# EAGLE design DEC8L-buscon (EAGLE 6.6.0)
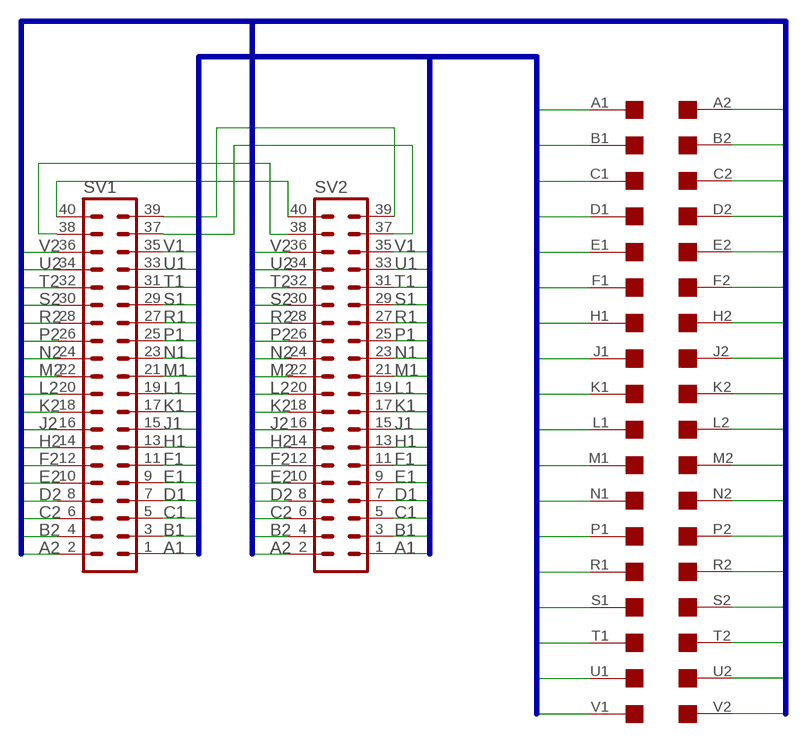
[diagram p0: schematic, sheet 1]

## Parts
SV1  MA20-2W  [MA20-2W]
SV2  MA20-2W  [MA20-2W]
U$1  DEC-FLIPCHIP  [DEC-FLIPCHIP]

## Nets
A1: SV1.1 SV2.1 U$1.A1
A2: SV1.2 SV2.2 U$1.A2
B1: SV1.3 SV2.3 U$1.B1
B2: SV1.4 SV2.4 U$1.B2
C1: SV1.5 SV2.5 U$1.C1
C2: SV1.6 SV2.6 U$1.C2
D1: SV1.7 SV2.7 U$1.D1
D2: SV1.8 SV2.8 U$1.D2
E1: SV1.9 SV2.9 U$1.E1
E2: SV1.10 SV2.10 U$1.E2
F1: SV1.11 SV2.11 U$1.F1
F2: SV1.12 SV2.12 U$1.F2
H1: SV1.13 SV2.13 U$1.H1
H2: SV1.14 SV2.14 U$1.H2
J1: SV1.15 SV2.15 U$1.J1
J2: SV1.16 SV2.16 U$1.J2
K1: SV1.17 SV2.17 U$1.K1
K2: SV1.18 SV2.18 U$1.K2
L1: SV1.19 SV2.19 U$1.L1
L2: SV1.20 SV2.20 U$1.L2
M1: SV1.21 SV2.21 U$1.M1
M2: SV1.22 SV2.22 U$1.M2
N1: SV1.23 SV2.23 U$1.N1
N2: SV1.24 SV2.24 U$1.N2
N$1: SV1.40 SV2.40
N$2: SV1.38 SV2.38
N$3: SV1.37 SV2.37
N$4: SV1.39 SV2.39
P1: SV1.25 SV2.25 U$1.P1
P2: SV1.26 SV2.26 U$1.P2
R1: SV1.27 SV2.27 U$1.R1
R2: SV1.28 SV2.28 U$1.R2
S1: SV1.29 SV2.29 U$1.S1
S2: SV1.30 SV2.30 U$1.S2
T1: SV1.31 SV2.31 U$1.T1
T2: SV1.32 SV2.32 U$1.T2
U1: SV1.33 SV2.33 U$1.U1
U2: SV1.34 SV2.34 U$1.U2
V1: SV1.35 SV2.35 U$1.V1
V2: SV1.36 SV2.36 U$1.V2

## Buses
A1,B1,C1,D1,E1,F1,H1,J1,K1,L1,M1,N1,P1,R1,S1,T1,U1,V1
A2,B2,C2,D2,E2,F2,H2,J2,K2,L2,M2,N2,P2,R2,S2,T2,U2,V2

## Library data of the parts
SV1 SV2 = con-lstb:MA20-2W: PIN HEADER; OC_FARNELL: unknown; OC_NEWARK: unknown
U$1 = con-dec:DEC-FLIPCHIP: DEC Flip-Chip single card fingers

## Board
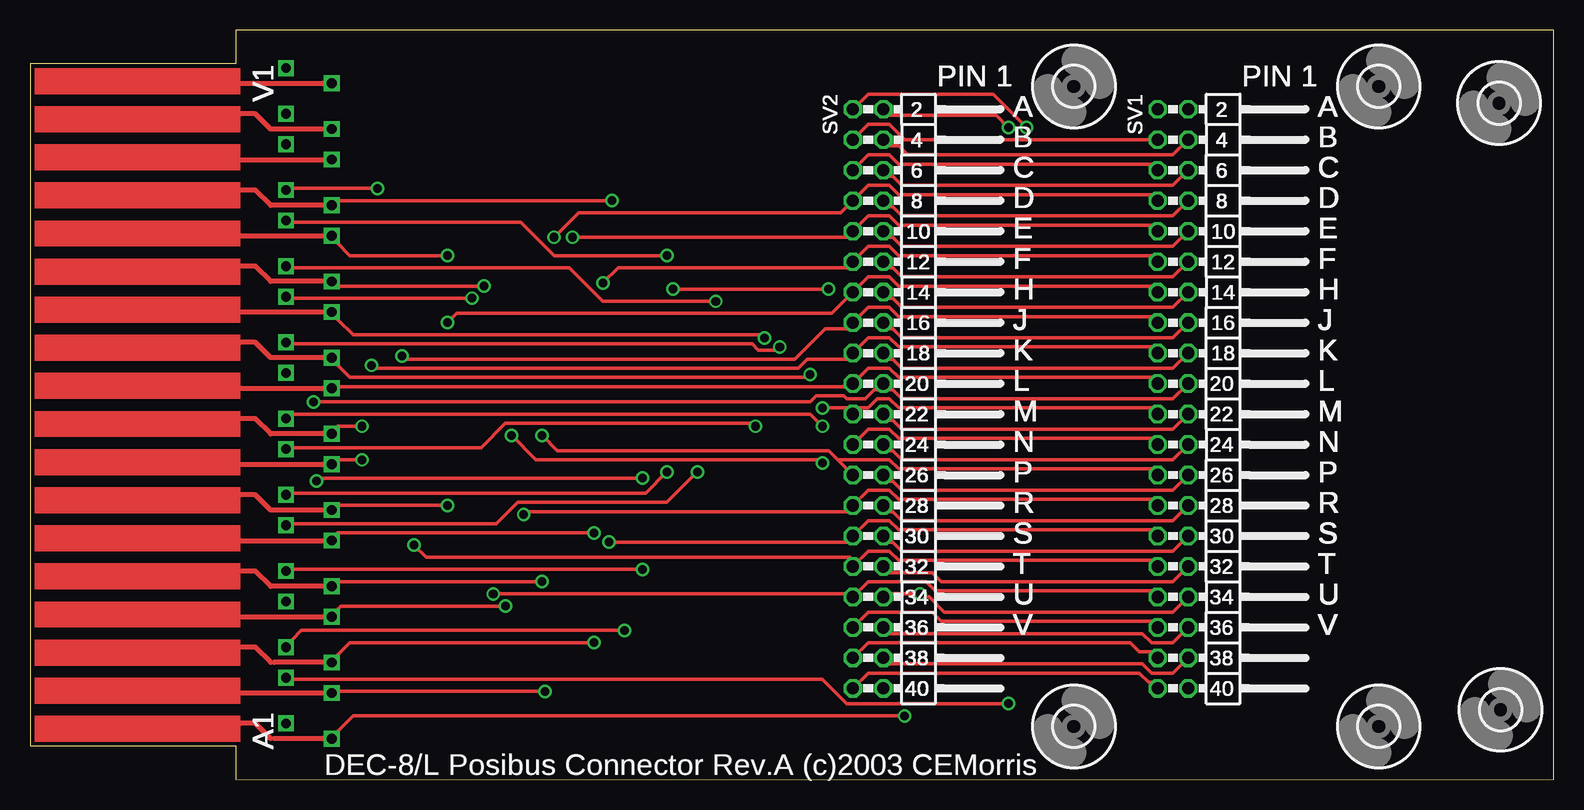
[diagram p1: board, top side]
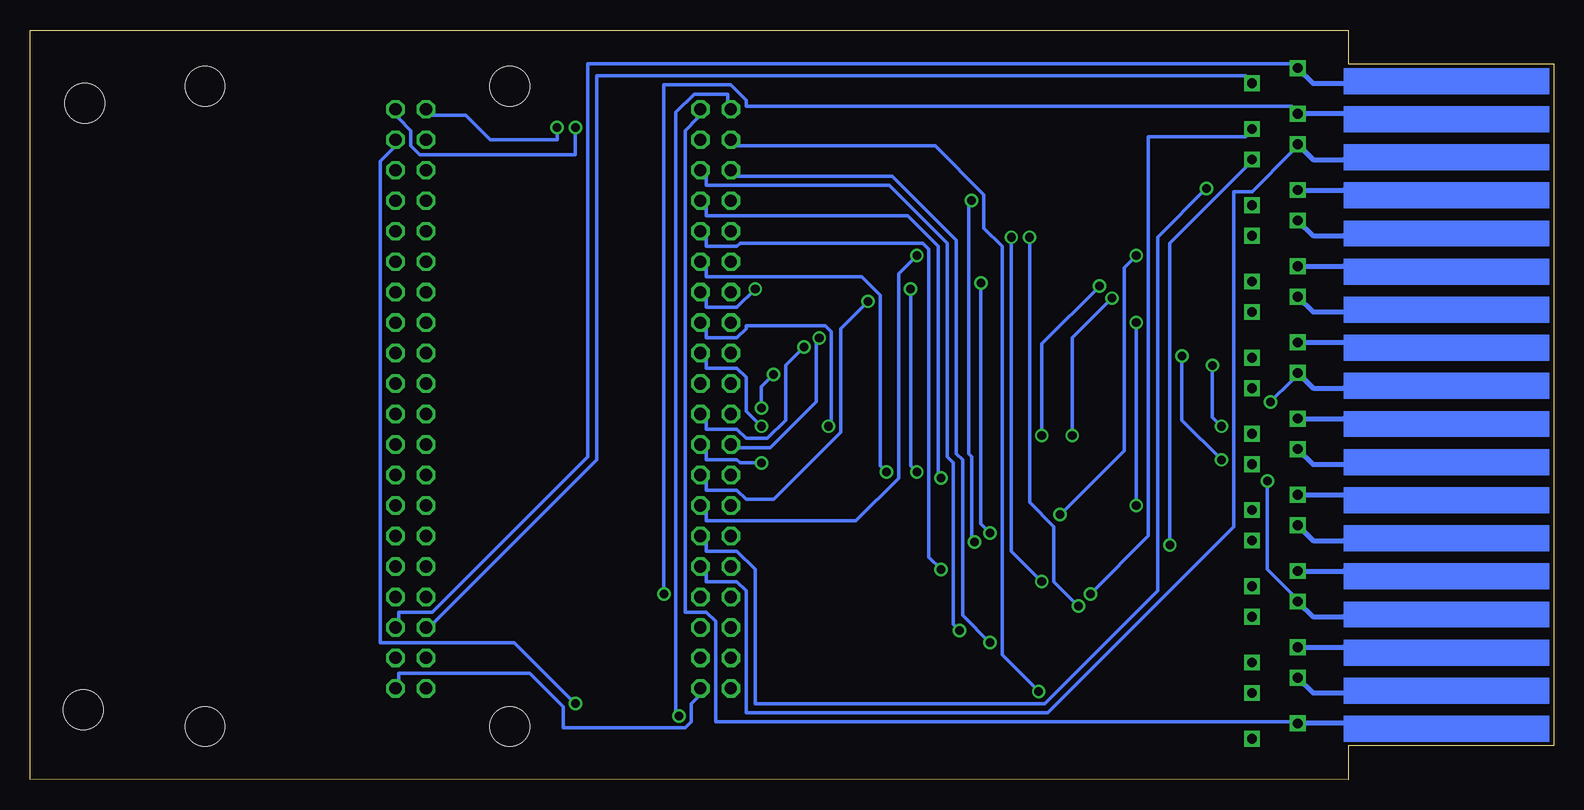
[diagram p2: board, bottom side, seen from below]

Size 126.98 x 62.48 mm. Coordinates in mm from the lower left corner, seen from the top.
Outline: 0,2.83 17.14,2.83 17.14,0 126.98,0.04 126.98,62.45 17.14,62.48 17.14,59.65 0,59.65 0,2.83
Copper layers (1*16): Top 0.035mm / dielectric 1.5mm / Bottom 0.035mm
Design rules "10mils": minimum track width 12mil, minimum drill 28mil, track to track 10mil, track to pad 10mil, pad to pad 10mil, via to via 10mil, smd to smd 10mil, copper to edge 40mil, drill to drill 10mil, minimum pad ring 10mil, minimum via ring 8mil, stop-mask expansion 0mil, vias tented up to drill 0mil, thermal gap 10mil

### Footprints (pad centres in the part's own frame; a part is rotated, then mirrored left to right if it is on the bottom)
MA20-2W = drill 1.016 octagon: 1 -24.13,-1.27; 2 -24.13,1.27; 3 -21.59,-1.27; 4 -21.59,1.27; 5 -19.05,-1.27; 6 -19.05,1.27; 7 -16.51,-1.27; 8 -16.51,1.27; 9 -13.97,-1.27; 10 -13.97,1.27; 11 -11.43,-1.27; 12 -11.43,1.27; 13 -8.89,-1.27; 14 -8.89,1.27; 15 -6.35,-1.27; 16 -6.35,1.27; 17 -3.81,-1.27; 18 -3.81,1.27; 19 -1.27,-1.27; 20 -1.27,1.27; 21 1.27,-1.27; 22 1.27,1.27; 23 3.81,-1.27; 24 3.81,1.27; 25 6.35,-1.27; 26 6.35,1.27; 27 8.89,-1.27; 28 8.89,1.27; 29 11.43,-1.27; 30 11.43,1.27; 31 13.97,-1.27; 32 13.97,1.27; 33 16.51,-1.27; 34 16.51,1.27; 35 19.05,-1.27; 36 19.05,1.27; 37 21.59,-1.27; 38 21.59,1.27; 39 24.13,-1.27; 40 24.13,1.27
DEC-FLIPCHIP = drill 0.813 square: A1 -7.62,27.94; A2 -3.81,26.67; B1 -7.62,24.13; B2 -3.81,22.86; C1 -7.62,21.59; C2 -3.81,20.32; D1 -7.62,17.78; D2 -3.81,16.51; E1 -7.62,15.24; E2 -3.81,13.97; F1 -7.62,11.43; F2 -3.81,10.16; H1 -7.62,8.89; H2 -3.81,7.62; J1 -7.62,5.08; J2 -3.81,3.81; K1 -7.62,2.54; K2 -3.81,1.27; L1 -7.62,-1.27; L2 -3.81,-2.54; M1 -7.62,-3.81; M2 -3.81,-5.08; N1 -7.62,-7.62; N2 -3.81,-8.89; P1 -7.62,-10.16; P2 -3.81,-11.43; R1 -7.62,-13.97; R2 -3.81,-15.24; S1 -7.62,-16.51; S2 -3.81,-17.78; T1 -7.62,-20.32; T2 -3.81,-21.59; U1 -7.62,-22.86; U2 -3.81,-24.13; V1 -7.62,-26.67; V2 -3.81,-27.94
3,3 = hole 3.3: 0,0

### Placement (x,y rotation side)
SV1  95.25,31.75 270 top
SV2  69.84,31.75 270 top
U$1  17.52,31.37 180 top
U$2  [3,3]  122.42,56.39 0 top
U$3  [3,3]  122.55,5.84 0 top
U$4  [3,3]  86.99,57.78 0 top
U$5  [3,3]  86.99,4.45 0 top
U$6  [3,3]  112.39,4.45 0 top
U$7  [3,3]  112.39,57.78 0 top

### Tracks (layer width: path | path; a pad name or v marks a point on that pad's centre or on a via)
A1  (via drill 0.71)
  Top 0.305: v72.89,5.33 26.92,5.33 25.65,4.06 U$1.A1 | v83.05,54.36 80.26,57.15 69.84,57.15 SV2.1
  Bottom 0.305: v72.89,5.33 73.15,5.59 73.15,55.63 71.62,57.15 68.83,57.15 68.83,56.64 SV2.1 | v83.05,54.36 83.05,53.34 88.64,53.34 90.67,55.37 93.47,55.37 SV1.1
A2  (via drill 0.71)
  Top 0.305: v81.53,54.36 80.51,55.37 71.62,55.37 SV2.2
  Bottom 0.305: U$1.A2 21.84,4.83 69.84,4.83 69.84,13.21 70.61,13.97 72.39,13.97 72.39,54.1 71.37,55.12 SV2.2 | v81.53,54.36 81.53,52.07 94.48,52.07 95.25,52.83 95.25,54.1 96.26,55.12 SV1.2
B1  (via drill 0.71)
  Top 0.305: v42.92,7.37 25.65,7.37 U$1.B1 | SV1.3 72.89,53.34 71.62,54.61 69.84,54.61 SV2.3
  Bottom 0.305: v42.92,7.37 45.97,10.41 45.97,44.45 47.49,45.97 47.49,48.77 51.56,52.83 68.07,52.83 SV2.3
B2  (via drill 0.71)
  Top 0.305: v81.53,6.35 68.07,6.35 66.04,8.38 21.84,8.38 U$1.B2 | SV2.4 71.62,52.83 72.39,52.83 73.15,52.07 95.25,52.07 SV1.4
  Bottom 0.305: v81.53,6.35 86.61,11.43 97.79,11.43 97.79,51.56 96.77,52.58 SV1.4
C1  (via drill 0.71)
  Top 0.305: v46.98,11.43 26.67,11.43 25.65,10.41 U$1.C1 | SV1.5 93.47,51.31 72.39,51.31 71.62,52.07 69.84,52.07 SV2.5
  Bottom 0.305: v46.98,11.43 49.27,13.72 49.27,26.67 49.78,27.18 49.78,44.96 55.11,50.29 68.07,50.29 SV2.5
C2  (via drill 0.71)
  Top 0.305: v49.52,12.45 22.6,12.45 21.84,11.68 U$1.C2 | SV1.6 95.25,49.53 72.64,49.53 71.88,50.29 71.62,50.29 SV2.6
  Bottom 0.305: v49.52,12.45 50.03,12.95 50.03,26.42 50.54,26.92 50.54,44.7 55.37,49.53 70.61,49.53 70.61,50.29 SV2.6
D1  (via drill 0.71)
  Top 0.305: v39.62,14.48 25.9,14.48 25.65,14.22 U$1.D1 | v43.68,45.21 45.71,47.24 67.56,47.24 SV2.7 69.84,49.53 71.62,49.53 72.39,48.77 93.47,48.77 SV1.7
  Bottom 0.305: v39.62,14.48 41.65,16.51 41.65,21.08 43.68,23.11 v43.68,45.21
D2  (via drill 0.71)
  Top 0.305: v23.87,24.89 24.12,25.15 v51.05,25.15 | SV1.8 95.25,46.99 72.64,46.99 71.88,47.75 71.62,47.75 SV2.8
  Bottom 0.305: v23.87,24.89 23.87,17.53 21.84,15.49 U$1.D2 | v51.05,25.15 51.3,25.4 51.3,44.45 53.84,46.99 70.61,46.99 70.61,47.75 SV2.8
E1  (via drill 0.71)
  Top 0.305: v42.67,16.51 25.65,16.51 U$1.E1 | v45.21,45.21 68.07,45.21 SV2.9 69.84,46.99 71.62,46.99 72.39,46.23 93.47,46.23 SV1.9
  Bottom 0.305: v42.67,16.51 45.21,19.05 v45.21,45.21
E2  (via drill 0.71)
  Top 0.305: v51.05,17.53 21.84,17.53 U$1.E2 | SV1.10 95.25,44.45 72.64,44.45 71.88,45.21 71.62,45.21 SV2.10
  Bottom 0.305: v51.05,17.53 52.06,18.54 52.06,44.2 52.57,44.7 67.81,44.7 68.07,44.45 70.61,44.45 70.61,45.21 SV2.10
F1  (via drill 0.71)
  Top 0.305: v46.98,20.57 25.65,20.57 U$1.F1 | v47.75,41.4 49.02,42.67 68.07,42.67 SV2.11 69.84,44.45 71.62,44.45 72.39,43.69 93.47,43.69 SV1.11
  Bottom 0.305: v46.98,20.57 47.75,21.34 v47.75,41.4
F2  (via drill 0.71)
  Top 0.305: v55.62,25.65 53.08,23.11 40.63,23.11 38.86,21.34 21.84,21.34 U$1.F2 | SV1.12 95.25,41.91 72.64,41.91 71.88,42.67 71.62,42.67 SV2.12
  Bottom 0.305: v55.62,25.65 56.13,26.16 56.13,40.39 57.65,41.91 70.61,41.91 70.61,42.67 SV2.12
H1  (via drill 0.71)
  Top 0.305: v34.79,22.86 25.65,22.86 U$1.H1 | v34.79,38.1 35.55,38.86 66.8,38.86 SV2.13 69.84,41.91 71.62,41.91 72.39,41.15 93.47,41.15 SV1.13
  Bottom 0.305: v34.79,22.86 v34.79,38.1
H2  (via drill 0.71)
  Top 0.305: v53.08,25.65 51.3,23.88 21.84,23.88 U$1.H2 | v53.59,40.89 v66.54,40.89 | SV1.14 95.25,39.37 72.64,39.37 71.88,40.13 71.62,40.13 SV2.14
  Bottom 0.305: v53.08,25.65 53.59,26.16 v53.59,40.89 | v66.54,40.89 68.07,39.37 70.61,39.37 70.61,40.13 SV2.14
J1  (via drill 0.71)
  Top 0.305: v27.68,26.67 25.65,26.67 U$1.J1 | v30.98,35.31 31.24,35.05 63.75,35.05 66.29,37.59 68.07,37.59 SV2.15 69.84,39.37 71.62,39.37 72.39,38.61 93.47,38.61 SV1.15
  Bottom 0.305: v27.68,26.67 30.98,29.97 v30.98,35.31
J2  (via drill 0.71)
  Top 0.305: v60.45,29.46 60.19,29.72 39.62,29.72 37.59,27.69 21.84,27.69 U$1.J2 | SV1.16 95.25,36.83 72.64,36.83 71.88,37.59 71.62,37.59 SV2.16
  Bottom 0.305: v60.45,29.46 60.19,29.72 60.19,37.34 60.7,37.85 67.31,37.85 67.31,37.59 68.07,36.83 70.61,36.83 70.61,37.59 SV2.16
K1  (via drill 0.71)
  Top 0.305: v27.68,29.46 25.65,29.46 U$1.K1 | v28.44,34.54 28.7,34.29 64,34.29 64.77,35.05 68.07,35.05 SV2.17 69.84,36.83 71.62,36.83 72.39,36.07 93.47,36.07 SV1.17
  Bottom 0.305: v27.68,29.46 28.44,30.23 v28.44,34.54
K2  (via drill 0.71)
  Top 0.305: v66.04,29.46 65.02,30.48 21.84,30.48 U$1.K2 | SV1.18 95.25,34.29 72.64,34.29 71.88,35.05 71.62,35.05 SV2.18
  Bottom 0.305: v66.04,29.46 67.31,30.73 67.31,33.53 68.07,34.29 70.61,34.29 70.61,35.05 SV2.18
L1
  Top 0.305: U$1.L1 25.65,32.77 68.07,32.77 SV2.19 69.84,34.29 71.62,34.29 72.39,33.53 93.47,33.53 SV1.19
L2  (via drill 0.71)
  Top 0.305: v23.62,31.5 65.02,31.5 65.53,32 67.81,32 68.07,31.75 69.59,31.75 70.35,32.51 70.61,32.51 SV2.20 71.62,32.51 71.88,32.51 72.64,31.75 95.25,31.75 SV1.20
  Bottom 0.305: v23.62,31.5 21.84,33.27 U$1.L2
M1  (via drill 0.71)
  Top 0.305: v65.02,33.78 64.77,33.53 26.67,33.53 25.65,34.54 U$1.M1 | v66.04,30.99 68.07,30.99 SV2.21 69.08,30.99 69.84,30.99 70.61,31.75 71.62,31.75 72.39,30.99 93.47,30.99 SV1.21
  Bottom 0.305: v65.02,33.78 66.04,32.77 v66.04,30.99
M2  (via drill 0.71)
  Top 0.305: v62.48,36.07 62.22,35.81 60.7,35.81 60.19,36.32 21.84,36.32 U$1.M2 | SV1.22 95.25,29.21 72.64,29.21 71.88,29.97 71.62,29.97 SV2.22
  Bottom 0.305: v62.48,36.07 64,34.54 64,29.97 65.53,28.45 67.31,28.45 68.07,29.21 70.61,29.21 70.61,29.97 SV2.22
N1  (via drill 0.71)
  Top 0.305: v61.21,36.83 60.95,37.08 26.92,37.08 25.65,38.35 U$1.N1 | SV1.23 93.47,28.45 72.39,28.45 71.62,29.21 69.84,29.21 SV2.23
  Bottom 0.305: v61.21,36.83 61.46,36.58 61.46,31.5 65.27,27.69 68.07,27.69 SV2.23
N2  (via drill 0.71)
  Top 0.305: v36.82,40.13 21.84,40.13 U$1.N2 | v40.13,28.7 42.16,26.67 65.78,26.67 v66.04,26.42 | SV1.24 95.25,26.67 72.64,26.67 71.88,27.43 71.62,27.43 SV2.24
  Bottom 0.305: v36.82,40.13 40.13,36.83 v40.13,28.7 | v66.04,26.42 67.81,26.42 68.07,26.67 70.61,26.67 70.61,27.43 SV2.24
N$1
  Bottom 0.305: SV2.40 71.37,6.86 71.88,6.35 71.88,4.83 72.39,4.32 82.55,4.32 82.55,6.1 85.34,8.89 96.26,8.89 96.26,8.38 SV1.40
N$2
  Top 0.305: SV2.38 71.62,9.65 92.7,9.65 93.47,8.89 95.25,8.89 SV1.38
N$3
  Top 0.305: SV2.37 69.84,11.43 91.69,11.43 92.45,10.67 93.47,10.67 SV1.37
N$4
  Top 0.305: SV2.39 69.84,8.89 92.45,8.89 93.21,8.13 93.47,8.13 SV1.39
P1  (via drill 0.71)
  Top 0.305: v37.84,41.15 25.65,41.15 U$1.P1 | v42.67,28.7 43.94,27.43 66.54,27.43 67.31,26.67 | 67.31,26.67 SV2.25 | 67.31,26.67 71.62,26.67 72.39,25.91 93.47,25.91 SV1.25
  Bottom 0.305: v37.84,41.15 42.67,36.32 v42.67,28.7
P2  (via drill 0.71)
  Top 0.305: v57.14,39.88 47.75,39.88 44.95,42.67 21.84,42.67 U$1.P2 | SV1.26 95.25,24.13 72.64,24.13 71.88,24.89 71.62,24.89 SV2.26
  Bottom 0.305: v57.14,39.88 59.43,37.59 59.43,28.96 65.02,23.37 67.31,23.37 68.07,24.13 70.61,24.13 70.61,24.89 SV2.26
R1  (via drill 0.71)
  Top 0.305: v34.79,43.69 26.67,43.69 25.65,44.7 U$1.R1 | v41.14,22.1 41.4,22.35 68.07,22.35 SV2.27 69.84,24.13 71.62,24.13 72.39,23.37 93.47,23.37 SV1.27
  Bottom 0.305: v34.79,43.69 35.81,42.67 35.81,27.43 v41.14,22.1
R2  (via drill 0.71)
  Top 0.305: v53.08,43.69 43.68,43.69 40.89,46.48 21.84,46.48 U$1.R2 | SV1.28 95.25,21.59 72.64,21.59 71.88,22.35 71.62,22.35 SV2.28
  Bottom 0.305: v53.08,43.69 54.6,42.16 54.6,25.15 58.16,21.59 70.61,21.59 70.61,22.35 SV2.28
S1  (via drill 0.71)
  Top 0.305: v48.51,48.26 25.65,48.26 U$1.S1 | v48.25,19.81 68.07,19.81 SV2.29 69.84,21.59 71.62,21.59 72.39,20.83 93.47,20.83 SV1.29
  Bottom 0.305: v48.51,48.26 48.76,48.01 48.76,27.18 48.51,26.92 48.51,20.07 v48.25,19.81
S2  (via drill 0.71)
  Top 0.305: v28.95,49.28 21.84,49.28 U$1.S2 | SV1.30 95.25,19.05 72.64,19.05 71.88,19.81 71.62,19.81 SV2.30
  Bottom 0.305: v28.95,49.28 33.02,45.21 33.02,15.75 42.41,6.35 66.54,6.35 66.54,17.53 68.07,19.05 70.61,19.05 70.61,19.81 SV2.30
T1  (via drill 0.71)
  Top 0.305: v32,19.56 33.02,18.54 68.32,18.54 SV2.31 69.84,19.05 71.62,19.05 72.39,18.29 93.47,18.29 SV1.31
  Bottom 0.305: v32,19.56 32,44.7 25.65,51.05 U$1.T1
T2
  Top 0.305: SV1.32 95.25,16.51 75.94,16.51 75.18,17.27 71.62,17.27 SV2.32
  Bottom 0.305: U$1.T2 21.84,52.32 25.14,49.02 26.67,49.02 26.67,21.08 42.16,5.59 67.31,5.59 67.31,15.75 68.07,16.51 70.61,16.51 70.61,17.27 SV2.32
U1  (via drill 0.71)
  Top 0.305: v38.6,15.49 68.07,15.49 SV2.33 69.84,16.51 74.67,16.51 75.43,15.75 93.47,15.75 SV1.33
  Bottom 0.305: v38.6,15.49 33.78,20.32 33.78,53.59 25.65,53.59 U$1.U1
U2  (via drill 0.71)
  Top 0.305: SV2.34 71.62,15.49 v74.16,15.49 74.67,15.24 74.93,15.24 76.2,13.97 95.25,13.97 SV1.34
  Bottom 0.305: v74.16,15.49 74.16,57.91 68.58,57.91 67.31,56.64 67.31,56.13 21.84,56.13 U$1.U2
V1
  Top 0.305: SV2.35 69.84,13.97 75.18,13.97 75.94,13.21 93.47,13.21 SV1.35
  Bottom 0.305: U$1.V1 25.65,58.67 79.75,58.67 79.75,26.67 93.47,12.95 SV1.35
V2
  Top 0.305: SV2.36 71.62,12.19 92.7,12.19 93.47,11.43 95.25,11.43 SV1.36
  Bottom 0.305: U$1.V2 21.84,59.69 80.51,59.69 80.51,26.92 93.47,13.97 96.26,13.97 96.26,13.46 SV1.36

### Text on the board
tPlace: 2 | 2 | 2 | 2 | 2 | 2 | 2 | 2 | 2 | 2 | 2 | 2 | 2 | 2 | 2 | 2 | 2 | 2 | 2 | 2 | 2 | 2 | 2 | 2 | 2 | 2 | 2 | 2 | 2 | 2 | 2 | 2 | 2 | 2 | 2 | 2 | 2 | 2 | 2 | 2 | 2 | 2 | 2 | 2 | 2 | 2 | 2 | 2 | 2 | 2 | 2 | 2 | 2 | 2 | 2 | 2 | 2 | 2 | 2 | 2 | 2 | 2 | 4 | 4 | 4 | 4 | 4 | 4 | 4 | 4 | 4 | 4 | 4 | 4 | 4 | 4 | 4 | 4 | 4 | 4 | 4 | 4 | 4 | 4 | 4 | 4 | 4 | 4 | 4 | 4 | 4 | 4 | 4 | 4 | 4 | 4 | 4 | 4 | 4 | 4 | 4 | 4 | 4 | 4 | 4 | 4 | 4 | 4 | 4 | 4 | 4 | 4 | 4 | 4 | 4 | 4 | 4 | 4 | 4 | 4 | 4 | 4 | 4 | 4 | 6 | 6 | 6 | 6 | 6 | 6 | 6 | 6 | 6 | 6 | 6 | 6 | 6 | 6 | 6 | 6 | 6 | 6 | 6 | 6 | 6 | 6 | 6 | 6 | 6 | 6 | 6 | 6 | 6 | 6 | 6 | 6 | 6 | 6 | 6 | 6 | 6 | 6 | 6 | 6 | 6 | 6 | 6 | 6 | 6 | 6 | 6 | 6 | 6 | 6 | 6 | 6 | 6 | 6 | 6 | 6 | 6 | 6 | 6 | 6 | 6 | 6 | 8 | 8 | 8 | 8 | 8 | 8 | 8 | 8 | 8 | 8 | 8 | 8 | 8 | 8 | 8 | 8 | 8 | 8 | 8 | 8 | 8 | 8 | 8 | 8 | 8 | 8 | 8 | 8 | 8 | 8 | 8 | 8 | 8 | 8 | 8 | 8 | 8 | 8 | 8 | 8 | 8 | 8 | 8 | 8 | 8 | 8 | 8 | 8 | 8 | 8 | 8 | 8 | 8 | 8 | 8 | 8 | 8 | 8 | 8 | 8 | 8 | 8 | 10 | 10 | 10 | 10 | 10 | 10 | 10 | 10 | 10 | 10 | 10 | 10 | 10 | 10 | 10 | 10 | 10 | 10 | 10 | 10 | 10 | 10 | 10 | 10 | 10 | 10 | 10 | 10 | 10 | 10 | 10 | 10 | 10 | 10 | 10 | 10 | 10 | 10 | 10 | 10 | 10 | 10 | 10 | 10 | 10 | 10 | 10 | 10 | 10 | 10 | 10 | 10 | 10 | 10 | 10 | 10 | 10 | 10 | 10 | 10 | 10 | 10 | 12 | 12 | 12 | 12 | 12 | 12 | 12 | 12 | 12 | 12 | 12 | 12 | 12 | 12 | 12 | 12 | 12 | 12 | 12 | 12 | 12 | 12 | 12 | 12 | 12 | 12 | 12 | 12 | 12 | 12 | 12 | 12 | 12 | 12 | 12 | 12 | 12 | 12 | 12 | 12 | 12 | 12 | 12 | 12 | 12 | 12 | 12 | 12 | 12 | 12 | 12 | 12 | 12 | 12 | 12 | 12 | 12 | 12 | 12 | 12 | 12 | 12 | 14 | 14 | 14 | 14 | 14 | 14 | 14 | 14 | 14 | 14 | 14 | 14 | 14 | 14 | 14 | 14 | 14 | 14 | 14 | 14 | 14 | 14 | 14 | 14 | 14 | 14 | 14 | 14 | 14 | 14 | 14 | 14 | 14 | 14 | 14 | 14 | 14 | 14 | 14 | 14 | 14 | 14 | 14 | 14 | 14 | 14 | 14 | 14 | 14 | 14 | 14 | 14 | 14 | 14 | 14 | 14 | 14 | 14 | 14 | 14 | 14 | 14 | 16 | 16 | 16 | 16 | 16 | 16 | 16 | 16 | 16 | 16 | 16 | 16 | 16 | 16 | 16 | 16 | 16 | 16 | 16 | 16 | 16 | 16 | 16 | 16 | 16 | 16 | 16 | 16 | 16 | 16 | 16 | 16 | 16 | 16 | 16 | 16 | 16 | 16 | 16 | 16 | 16 | 16 | 16 | 16 | 16 | 16 | 16 | 16 | 16 | 16 | 16 | 16 | 16 | 16 | 16 | 16 | 16 | 16 | 16 | 16 | 16 | 16 | 18 | 18 | 18 | 18 | 18 | 18 | 18 | 18 | 18 | 18 | 18 | 18 | 18 | 18 | 18 | 18 | 18 | 18 | 18 | 18 | 18 | 18 | 18 | 18 | 18 | 18 | 18 | 18 | 18 | 18 | 18 | 18 | 18 | 18 | 18 | 18 | 18 | 18 | 18 | 18 | 18 | 18 | 18 | 18 | 18 | 18 | 18 | 18 | 18 | 18 | 18 | 18 | 18 | 18 | 18 | 18 | 18 | 18 | 18 | 18 | 18 | 18 | 20 | 20 | 20 | 20 | 20 | 20 | 20 | 20 | 20 | 20 | 20 | 20 | 20 | 20 | 20 | 20 | 20 | 20 | 20 | 20 | 20 | 20 | 20 | 20 | 20 | 20 | 20 | 20 | 20 | 20 | 20 | 20 | 20 | 20 | 20 | 20 | 20 | 20 | 20 | 20 | 20 | 20 | 20 | 20 | 20 | 20 | 20 | 20 | 20 | 20 | 20 | 20 | 20 | 20 | 20 | 20 | 20 | 20 | 20 | 20 | 20 | 20 | 22 | 22 | 22 | 22 | 22 | 22 | 22 | 22 | 22 | 22 | 22 | 22 | 22 | 22 | 22 | 22 | 22 | 22 | 22 | 22 | 22 | 22 | 22 | 22 | 22 | 22 | 22 | 22 | 22 | 22 | 22 | 22 | 22 | 22 | 22 | 22 | 22 | 22 | 22 | 22 | 22 | 22 | 22 | 22 | 22 | 22 | 22 | 22 | 22 | 22 | 22 | 22 | 22 | 22 | 22 | 22 | 22 | 22 | 22 | 22 | 22 | 22 | 24 | 24 | 24 | 24 | 24 | 24 | 24 | 24 | 24 | 24 | 24 | 24 | 24 | 24 | 24 | 24 | 24 | 24 | 24 | 24 | 24 | 24 | 24 | 24 | 24 | 24 | 24 | 24 | 24 | 24 | 24 | 24 | 24 | 24 | 24 | 24 | 24 | 24 | 24 | 24 | 24 | 24 | 24 | 24 | 24 | 24 | 24 | 24 | 24 | 24 | 24 | 24 | 24 | 24 | 24 | 24 | 24 | 24 | 24 | 24 | 24 | 24 | 26 | 26 | 26 | 26 | 26 | 26 | 26 | 26 | 26 | 26 | 26 | 26 | 26 | 26 | 26 | 26 | 26 | 26 | 26 | 26 | 26 | 26 | 26 | 26 | 26 | 26 | 26 | 26 | 26 | 26 | 26 | 26 | 26 | 26 | 26 | 26 | 26 | 26 | 26 | 26 | 26 | 26 | 26 | 26 | 26 | 26 | 26 | 26 | 26 | 26 | 26 | 26 | 26 | 26 | 26 | 26 | 26 | 26 | 26 | 26 | 26 | 26 | 28 | 28 | 28 | 28 | 28 | 28 | 28 | 28 | 28 | 28 | 28 | 28 | 28 | 28 | 28 | 28 | 28 | 28 | 28 | 28 | 28 | 28 | 28 | 28 | 28 | 28 | 28 | 28 | 28 | 28 | 28 | 28 | 28 | 28 | 28 | 28 | 28 | 28 | 28 | 28 | 28 | 28 | 28 | 28 | 28 | 28 | 28 | 28 | 28 | 28 | 28 | 28 | 28 | 28 | 28 | 28 | 28 | 28 | 28 | 28 | 28 | 28 | 30 | 30 | 30 | 30 | 30 | 30 | 30 | 30 | 30 | 30 | 30 | 30 | 30 | 30 | 30 | 30 | 30 | 30 | 30 | 30 | 30 | 30 | 30 | 30 | 30 | 30 | 30 | 30 | 30 | 30 | 30 | 30 | 30 | 30 | 30 | 30 | 30 | 30 | 30 | 30 | 30 | 30 | 30 | 30 | 30 | 30 | 30 | 30 | 30 | 30 | 30 | 30 | 30 | 30 | 30 | 30 | 30 | 30 | 30 | 30 | 30 | 30 | 32 | 32 | 32 | 32 | 32 | 32 | 32 | 32 | 32 | 32 | 32 | 32 | 32 | 32 | 32 | 32 | 32 | 32 | 32 | 32 | 32 | 32 | 32 | 32 | 32 | 32 | 32 | 32 | 32 | 32 | 32 | 32 | 32 | 32 | 32 | 32 | 32 | 32 | 32 | 32 | 32 | 32 | 32 | 32 | 32 | 32 | 32 | 32 | 32 | 32 | 32 | 32 | 32 | 32 | 32 | 32 | 32 | 32 | 32 | 32 | 32 | 32 | 34 | 34 | 34 | 34 | 34 | 34 | 34 | 34 | 34 | 34 | 34 | 34 | 34 | 34 | 34 | 34 | 34 | 34 | 34 | 34 | 34 | 34 | 34 | 34 | 34 | 34 | 34 | 34 | 34 | 34 | 34 | 34 | 34 | 34 | 34 | 34 | 34 | 34 | 34 | 34 | 34 | 34 | 34 | 34 | 34 | 34 | 34 | 34 | 34 | 34 | 34 | 34 | 34 | 34 | 34 | 34 | 34 | 34 | 34 | 34 | 34 | 34 | 36 | 36 | 36 | 36 | 36 | 36 | 36 | 36 | 36 | 36 | 36 | 36 | 36 | 36 | 36 | 36 | 36 | 36 | 36 | 36 | 36 | 36 | 36 | 36 | 36 | 36 | 36 | 36 | 36 | 36 | 36 | 36 | 36 | 36 | 36 | 36 | 36 | 36 | 36 | 36 | 36 | 36 | 36 | 36 | 36 | 36 | 36 | 36 | 36 | 36 | 36 | 36 | 36 | 36 | 36 | 36 | 36 | 36 | 36 | 36 | 36 | 36 | 38 | 38 | 38 | 38 | 38 | 38 | 38 | 38 | 38 | 38 | 38 | 38 | 38 | 38 | 38 | 38 | 38 | 38 | 38 | 38 | 38 | 38 | 38 | 38 | 38 | 38 | 38 | 38 | 38 | 38 | 38 | 38 | 38 | 38 | 38 | 38 | 38 | 38 | 38 | 38 | 38 | 38 | 38 | 38 | 38 | 38 | 38 | 38 | 38 | 38 | 38 | 38 | 38 | 38 | 38 | 38 | 38 | 38 | 38 | 38 | 38 | 38 | 40 | 40 | 40 | 40 | 40 | 40 | 40 | 40 | 40 | 40 | 40 | 40 | 40 | 40 | 40 | 40 | 40 | 40 | 40 | 40 | 40 | 40 | 40 | 40 | 40 | 40 | 40 | 40 | 40 | 40 | 40 | 40 | 40 | 40 | 40 | 40 | 40 | 40 | 40 | 40 | 40 | 40 | 40 | 40 | 40 | 40 | 40 | 40 | 40 | 40 | 40 | 40 | 40 | 40 | 40 | 40 | 40 | 40 | 40 | 40 | 40 | 40
tNames: PIN 1 | PIN 1 | PIN 1 | PIN 1 | PIN 1 | PIN 1 | PIN 1 | PIN 1 | PIN 1 | PIN 1 | PIN 1 | PIN 1 | PIN 1 | PIN 1 | PIN 1 | PIN 1 | PIN 1 | PIN 1 | PIN 1 | PIN 1 | PIN 1 | PIN 1 | PIN 1 | PIN 1 | PIN 1 | PIN 1 | PIN 1 | PIN 1 | PIN 1 | PIN 1 | PIN 1 | PIN 1 | PIN 1 | PIN 1 | PIN 1 | PIN 1 | PIN 1 | PIN 1 | PIN 1 | PIN 1 | PIN 1 | PIN 1 | PIN 1 | PIN 1 | PIN 1 | PIN 1 | PIN 1 | PIN 1 | PIN 1 | PIN 1 | PIN 1 | PIN 1 | PIN 1 | PIN 1 | PIN 1 | PIN 1 | PIN 1 | PIN 1 | PIN 1 | PIN 1 | PIN 1 | PIN 1 | PIN 1 | PIN 1 | V1 | V1 | V1 | V1 | V1 | V1 | V1 | V1 | V1 | V1 | V1 | V1 | V1 | V1 | V1 | V1 | V1 | V1 | V1 | V1 | V1 | V1 | V1 | V1 | V1 | V1 | V1 | V1 | V1 | V1 | V1 | V1 | SV2 | SV2 | SV2 | SV2 | SV2 | SV2 | SV2 | SV2 | SV2 | SV2 | SV2 | SV2 | SV2 | SV2 | SV2 | SV2 | SV2 | SV2 | SV2 | SV2 | SV2 | SV2 | SV2 | SV2 | SV2 | SV2 | SV2 | SV2 | SV2 | SV1 | SV1 | SV1 | SV1 | SV1 | SV1 | SV1 | SV1 | SV1 | SV1 | SV1 | SV1 | SV1 | SV1 | SV1 | SV1 | SV1 | SV1 | SV1 | SV1 | SV1 | SV1 | SV1 | SV1 | SV1 | SV1 | SV1 | SV1 | SV1 | A | A | A | A | A | A | A | A | A | A | A | A | A | A | A | A | A | A | A | A | A | A | A | A | A | A | A | A | A | A | A | A | A | A | A | A | A | A | A | A | A | A | A | A | A | A | A | A | A | A | A | A | A | A | A | A | A | A | A | A | A | A | A | A | B | B | B | B | B | B | B | B | B | B | B | B | B | B | B | B | B | B | B | B | B | B | B | B | B | B | B | B | B | B | B | B | B | B | B | B | B | B | B | B | B | B | B | B | B | B | B | B | B | B | B | B | B | B | B | B | B | B | B | B | B | B | B | B | C | C | C | C | C | C | C | C | C | C | C | C | C | C | C | C | C | C | C | C | C | C | C | C | C | C | C | C | C | C | C | C | C | C | C | C | C | C | C | C | C | C | C | C | C | C | C | C | C | C | C | C | C | C | C | C | C | C | C | C | C | C | C | C | D | D | D | D | D | D | D | D | D | D | D | D | D | D | D | D | D | D | D | D | D | D | D | D | D | D | D | D | D | D | D | D | D | D | D | D | D | D | D | D | D | D | D | D | D | D | D | D | D | D | D | D | D | D | D | D | D | D | D | D | D | D | D | D | E | E | E | E | E | E | E | E | E | E | E | E | E | E | E | E | E | E | E | E | E | E | E | E | E | E | E | E | E | E | E | E | E | E | E | E | E | E | E | E | E | E | E | E | E | E | E | E | E | E | E | E | E | E | E | E | E | E | E | E | E | E | E | E | F | F | F | F | F | F | F | F | F | F | F | F | F | F | F | F | F | F | F | F | F | F | F | F | F | F | F | F | F | F | F | F | F | F | F | F | F | F | F | F | F | F | F | F | F | F | F | F | F | F | F | F | F | F | F | F | F | F | F | F | F | F | F | F | H | H | H | H | H | H | H | H | H | H | H | H | H | H | H | H | H | H | H | H | H | H | H | H | H | H | H | H | H | H | H | H | H | H | H | H | H | H | H | H | H | H | H | H | H | H | H | H | H | H | H | H | H | H | H | H | H | H | H | H | H | H | H | H | J | J | J | J | J | J | J | J | J | J | J | J | J | J | J | J | J | J | J | J | J | J | J | J | J | J | J | J | J | J | J | J | J | J | J | J | J | J | J | J | J | J | J | J | J | J | J | J | J | J | J | J | J | J | J | J | J | J | J | J | J | J | J | J | K | K | K | K | K | K | K | K | K | K | K | K | K | K | K | K | K | K | K | K | K | K | K | K | K | K | K | K | K | K | K | K | K | K | K | K | K | K | K | K | K | K | K | K | K | K | K | K | K | K | K | K | K | K | K | K | K | K | K | K | K | K | K | K | L | L | L | L | L | L | L | L | L | L | L | L | L | L | L | L | L | L | L | L | L | L | L | L | L | L | L | L | L | L | L | L | L | L | L | L | L | L | L | L | L | L | L | L | L | L | L | L | L | L | L | L | L | L | L | L | L | L | L | L | L | L | L | L | M | M | M | M | M | M | M | M | M | M | M | M | M | M | M | M | M | M | M | M | M | M | M | M | M | M | M | M | M | M | M | M | M | M | M | M | M | M | M | M | M | M | M | M | M | M | M | M | M | M | M | M | M | M | M | M | M | M | M | M | M | M | M | M | N | N | N | N | N | N | N | N | N | N | N | N | N | N | N | N | N | N | N | N | N | N | N | N | N | N | N | N | N | N | N | N | N | N | N | N | N | N | N | N | N | N | N | N | N | N | N | N | N | N | N | N | N | N | N | N | N | N | N | N | N | N | N | N | P | P | P | P | P | P | P | P | P | P | P | P | P | P | P | P | P | P | P | P | P | P | P | P | P | P | P | P | P | P | P | P | P | P | P | P | P | P | P | P | P | P | P | P | P | P | P | P | P | P | P | P | P | P | P | P | P | P | P | P | P | P | P | P | R | R | R | R | R | R | R | R | R | R | R | R | R | R | R | R | R | R | R | R | R | R | R | R | R | R | R | R | R | R | R | R | R | R | R | R | R | R | R | R | R | R | R | R | R | R | R | R | R | R | R | R | R | R | R | R | R | R | R | R | R | R | R | R | S | S | S | S | S | S | S | S | S | S | S | S | S | S | S | S | S | S | S | S | S | S | S | S | S | S | S | S | S | S | S | S | S | S | S | S | S | S | S | S | S | S | S | S | S | S | S | S | S | S | S | S | S | S | S | S | S | S | S | S | S | S | S | S | T | T | T | T | T | T | T | T | T | T | T | T | T | T | T | T | T | T | T | T | T | T | T | T | T | T | T | T | T | T | T | T | T | T | T | T | T | T | T | T | T | T | T | T | T | T | T | T | T | T | T | T | T | T | T | T | T | T | T | T | T | T | T | T | U | U | U | U | U | U | U | U | U | U | U | U | U | U | U | U | U | U | U | U | U | U | U | U | U | U | U | U | U | U | U | U | U | U | U | U | U | U | U | U | U | U | U | U | U | U | U | U | U | U | U | U | U | U | U | U | U | U | U | U | U | U | U | U | V | V | V | V | V | V | V | V | V | V | V | V | V | V | V | V | V | V | V | V | V | V | V | V | V | V | V | V | V | V | V | V | V | V | V | V | V | V | V | V | V | V | V | V | V | V | V | V | V | V | V | V | V | V | V | V | V | V | V | V | V | V | V | V | A1 | A1 | A1 | A1 | A1 | A1 | A1 | A1 | A1 | A1 | A1 | A1 | A1 | A1 | A1 | A1 | A1 | A1 | A1 | A1 | A1 | A1 | A1 | A1 | A1 | A1 | A1 | A1 | A1 | A1 | A1 | A1 | DEC-8/L Posibus Connector Rev.A (c)2003 CEMorris | DEC-8/L Posibus Connector Rev.A (c)2003 CEMorris